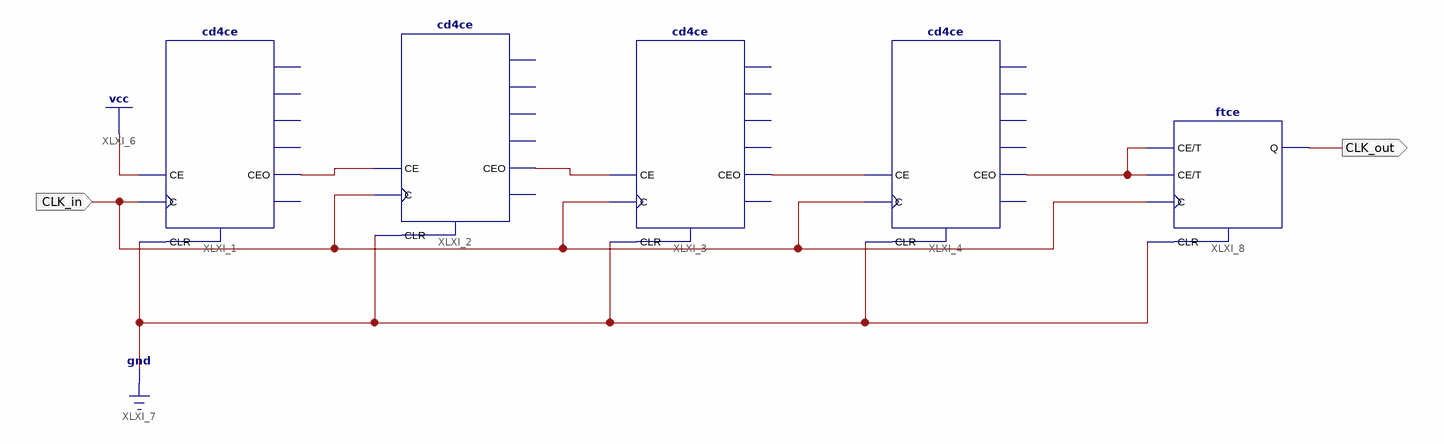
[diagram p0: schematic sheet 1]
// Xilinx ISE schematic Div20k.sch (spartan6) as structural Verilog: 5 symbols, 2 ports
module Div20k (
  input  CLK_in,
  output CLK_out
);

  wire XLXN_11, XLXN_12, XLXN_13, XLXN_14;

  cd4ce XLXI_1 (.C(CLK_in), .CE(1'b1), .CLR(1'b0), .CEO(XLXN_14));  // open: Q0, Q1, Q2, Q3, TC
  cd4ce XLXI_2 (.C(CLK_in), .CE(XLXN_14), .CLR(1'b0), .CEO(XLXN_13));  // open: Q0, Q1, Q2, Q3, TC
  cd4ce XLXI_3 (.C(CLK_in), .CE(XLXN_13), .CLR(1'b0), .CEO(XLXN_12));  // open: Q0, Q1, Q2, Q3, TC
  cd4ce XLXI_4 (.C(CLK_in), .CE(XLXN_12), .CLR(1'b0), .CEO(XLXN_11));  // open: Q0, Q1, Q2, Q3, TC
  ftce XLXI_8 (.C(CLK_in), .CE(XLXN_11), .CLR(1'b0), .T(XLXN_11), .Q(CLK_out));
endmodule
